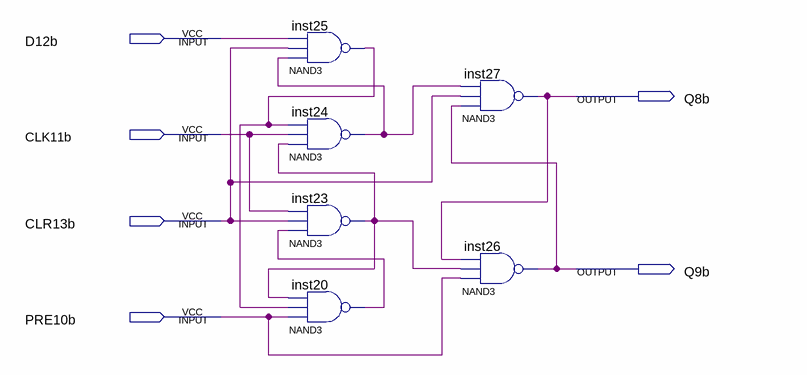
[diagram p0: schematic sheet]
// Quartus schematic 74LS74b_2.bdf as structural Verilog: 6 symbols, 6 pins
module \74LS74b_2  (
  input  D12b,
  input  CLK11b,
  input  CLR13b,
  input  PRE10b,
  output Q8b,
  output Q9b
);

  wire inst20_out, inst23_out, inst24_out, inst25_out;

  nand inst25 (inst25_out, inst24_out, CLR13b, D12b);
  nand inst24 (inst24_out, inst23_out, CLK11b, inst25_out);
  nand inst23 (inst23_out, inst20_out, CLR13b, CLK11b);
  nand inst20 (inst20_out, PRE10b, inst25_out, inst23_out);
  nand inst27 (Q8b, Q9b, CLR13b, inst24_out);
  nand inst26 (Q9b, PRE10b, inst23_out, Q8b);
endmodule
